# Altium project ACAMP.PrjPcb
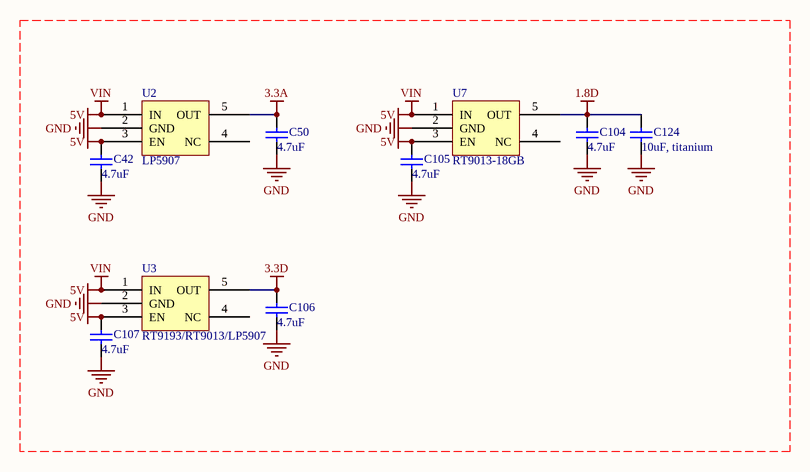
[diagram p0: power.SchDoc]
4 sheets, 97 parts. Net scope: flat (ports and power ports of the same name join across sheets).
Board file: ACAMP.PcbDoc
Sheets:
  power.SchDoc
  CPLD.SchDoc
  mcu.SchDoc
  ADC.SchDoc

## Sheet power.SchDoc
size A4

### Parts
C42  4.7uF  [0603]
C50  4.7uF  [0603]
C104  4.7uF  [0603]
C105  4.7uF  [0603]
C106  4.7uF  [0603]
C107  4.7uF  [0603]
C124  10uF, titanium  [0805]
U2  LP5907  [SOT23-5]
U3  RT9193/RT9013/LP5907  [SOT23-5]
U7  RT9013-18GB  [SOT23-5]

### Nets
1.8D: C104.2 C124.2 U7.5(OUT)
3.3A: C50.2 U2.5(OUT)
3.3D: C106.2 U3.5(OUT)
5V: C42.2 C105.2 C107.2 U2.1(IN) U2.3(EN) U3.1(IN) U3.3(EN) U7.1(IN) U7.3(EN)  [also labelled VIN]
GND: C42.1 C50.1 C104.1 C105.1 C106.1 C107.1 C124.1 U2.2(GND) U3.2(GND) U7.2(GND)

Not connected (* = marked no-connect by the designer): U2 4(NC); U3 4(NC); U7 4(NC)

### Library data of the parts
C42 C50 C104-C107 C124 = Cap: Capacitor; Published: 8-Jun-2000; LatestRevisionDate: 17-Jul-2002; LatestRevisionNote: Re-released for DXP Platform.; PackageReference: RAD-0.3; Publisher: Altium Limited; PackageDescription: Radial Cap, Thru-Hole; 2 Leads; 0.3 in Pin Spacing
U3 U7 = LP5907

## Sheet CPLD.SchDoc
size A4
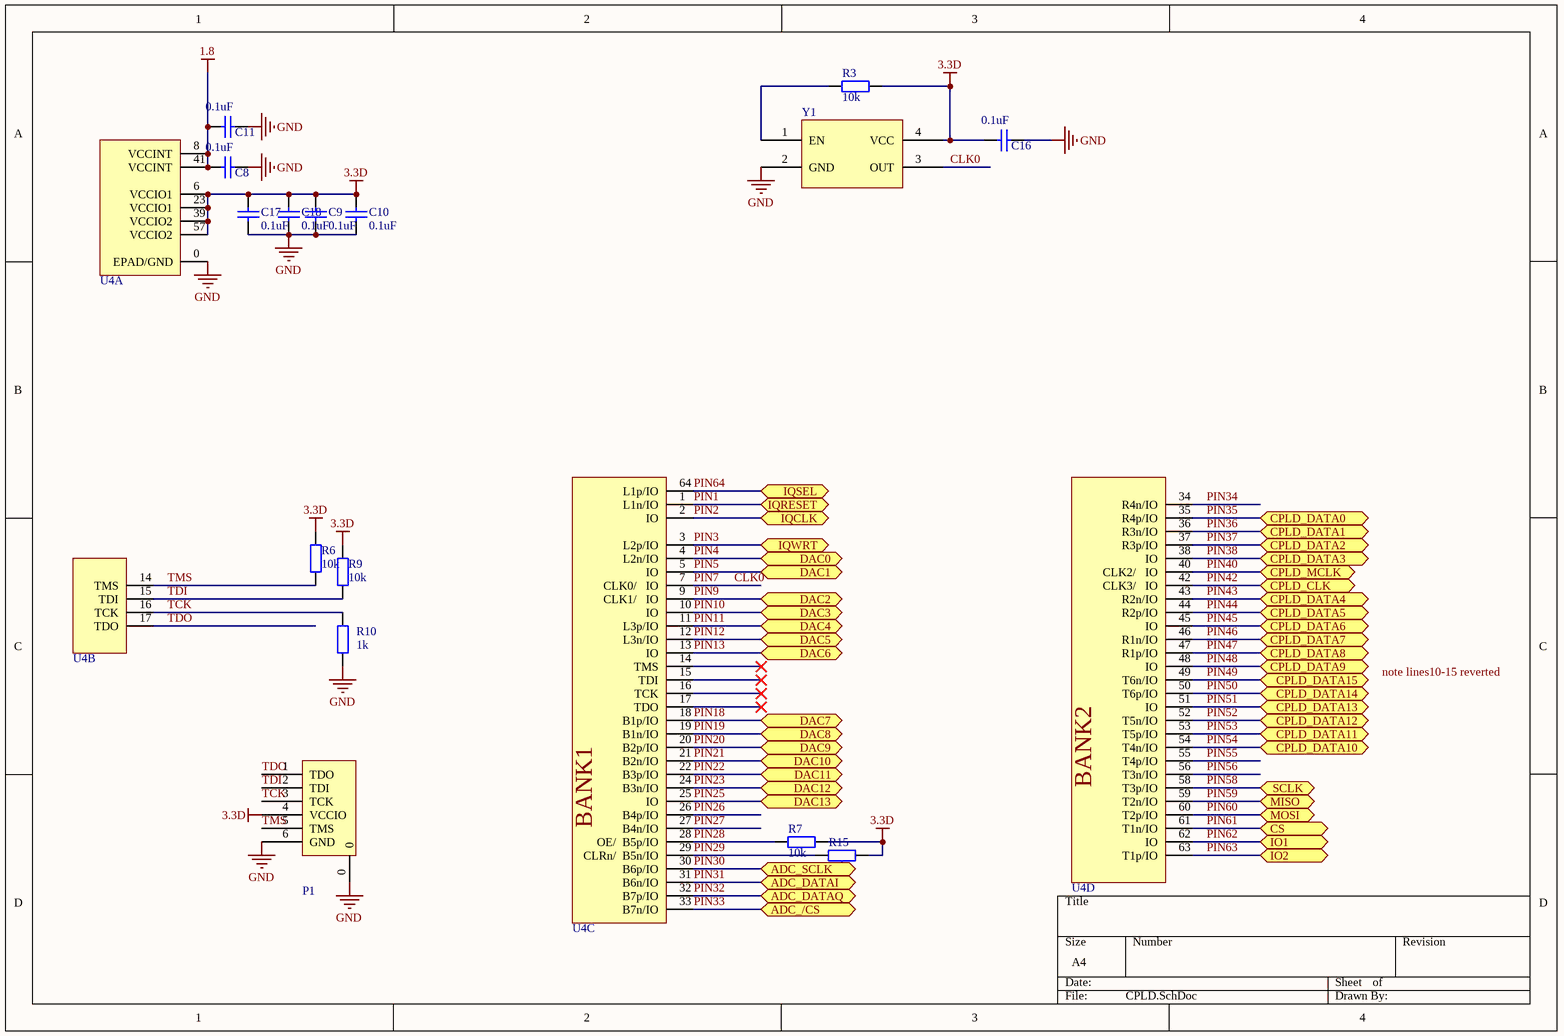
[diagram p1: CPLD.SchDoc]

### Parts
C8  0.1uF  [0402]
C9  0.1uF  [0402]
C10  0.1uF  [0402]
C11  0.1uF  [0402]
C16  0.1uF  [0402]
C17  0.1uF  [0402]
C18  0.1uF  [0402]
P1  JTAG-6P  [GH1.25-6]  (value not drawn)
R3  10k  [0402]
R6  10k  [0402]
R7  10k  [0402]
R9  10k  [0402]
R10  1k  [0402]
R15  10k  [0402]
U4  5M160ZE64  [5M160ZE64]  (value not drawn)  (parts A,B,C,D of 4)
Y1  OSC_50M  [TXC_7Q]  (value not drawn)

### Ports
ADC_/CS, ADC_DATAI, ADC_DATAQ, ADC_SCLK, CPLD_CLK, CPLD_DATA0, CPLD_DATA1, CPLD_DATA2, CPLD_DATA3, CPLD_DATA4, CPLD_DATA5, CPLD_DATA6, CPLD_DATA7, CPLD_DATA8, CPLD_DATA9, CPLD_DATA10, CPLD_DATA11, CPLD_DATA12, CPLD_DATA13, CPLD_DATA14, CPLD_DATA15, CPLD_MCLK, CS, DAC0, DAC1, DAC2, DAC3, DAC4, DAC5, DAC6, DAC7, DAC8, DAC9, DAC10, DAC11, DAC12, DAC13, IO1, IO2, IQCLK, IQRESET, IQSEL, IQWRT, MISO, MOSI, SCLK

### Nets
1.8: C8.2 C11.2 U4.8(VCCINT) U4.41(VCCINT)
3.3D: C9.2 C10.2 C16.2 C17.2 C18.2 P1.4(VCCIO) R3.2 R6.2 R7.2 R9.2 R15.2 U4.6(VCCIO1) U4.23(VCCIO1) U4.39(VCCIO2) U4.57(VCCIO2) Y1.4(VCC)
GND: C8.1 C9.1 C10.1 C11.1 C16.1 C17.1 C18.1 P1.0 P1.6(GND) R10.1 U4.0(EPAD/GND) Y1.2(GND)
CLK0: U4.7(CLK0/___IO) Y1.3(OUT)  [also labelled PIN7]
PIN1: U4.1(L1n/IO) ; port IQRESET
PIN2: U4.2(IO) ; port IQCLK
PIN3: U4.3(L2p/IO) ; port IQWRT
PIN4: U4.4(L2n/IO) ; port DAC0
PIN5: U4.5(IO) ; port DAC1
PIN9: U4.9(CLK1/___IO) ; port DAC2
PIN10: U4.10(IO) ; port DAC3
PIN11: U4.11(L3p/IO) ; port DAC4
PIN12: U4.12(L3n/IO) ; port DAC5
PIN13: U4.13(IO) ; port DAC6
PIN18: U4.18(B1p/IO) ; port DAC7
PIN19: U4.19(B1n/IO) ; port DAC8
PIN20: U4.20(B2p/IO) ; port DAC9
PIN21: U4.21(B2n/IO) ; port DAC10
PIN22: U4.22(B3p/IO) ; port DAC11
PIN23: U4.24(B3n/IO) ; port DAC12
PIN25: U4.25(IO) ; port DAC13
PIN26: U4.26(B4p/IO)
PIN27: U4.27(B4n/IO)
PIN28: R7.1 U4.28(OE/__B5p/IO)
PIN29: R15.1 U4.29(CLRn/__B5n/IO)
PIN30: U4.30(B6p/IO) ; port ADC_SCLK
PIN31: U4.31(B6n/IO) ; port ADC_DATAI
PIN32: U4.32(B7p/IO) ; port ADC_DATAQ
PIN33: U4.33(B7n/IO) ; port ADC_/CS
PIN34: U4.34(R4n/IO)
PIN35: U4.35(R4p/IO) ; port CPLD_DATA0
PIN36: U4.36(R3n/IO) ; port CPLD_DATA1
PIN37: U4.37(R3p/IO) ; port CPLD_DATA2
PIN38: U4.38(IO) ; port CPLD_DATA3
PIN40: U4.40(CLK2/___IO) ; port CPLD_MCLK
PIN42: U4.42(CLK3/___IO) ; port CPLD_CLK
PIN43: U4.43(R2n/IO) ; port CPLD_DATA4
PIN44: U4.44(R2p/IO) ; port CPLD_DATA5
PIN45: U4.45(IO) ; port CPLD_DATA6
PIN46: U4.46(R1n/IO) ; port CPLD_DATA7
PIN47: U4.47(R1p/IO) ; port CPLD_DATA8
PIN48: U4.48(IO) ; port CPLD_DATA9
PIN49: U4.49(T6n/IO) ; port CPLD_DATA15
PIN50: U4.50(T6p/IO) ; port CPLD_DATA14
PIN51: U4.51(IO) ; port CPLD_DATA13
PIN52: U4.52(T5n/IO) ; port CPLD_DATA12
PIN53: U4.53(T5p/IO) ; port CPLD_DATA11
PIN54: U4.54(T4n/IO) ; port CPLD_DATA10
PIN55: U4.55(T4p/IO)
PIN56: U4.56(T3n/IO)
PIN58: U4.58(T3p/IO) ; port SCLK
PIN59: U4.59(T2n/IO) ; port MISO
PIN60: U4.60(T2p/IO) ; port MOSI
PIN61: U4.61(T1n/IO) ; port CS
PIN62: U4.62(IO) ; port IO1
PIN63: U4.63(T1p/IO) ; port IO2
PIN64: U4.64(L1p/IO) ; port IQSEL
TCK: P1.3(TCK) R10.2 U4.16(TCK)
TDI: P1.2(TDI) R9.1 U4.15(TDI)
TDO: P1.1(TDO) U4.17(TDO)
TMS: P1.5(TMS) R6.1 U4.14(TMS)
NetR3_1: R3.1 Y1.1(EN)

### Notes on the sheet
- Labels drawn without touching a wire or pin: note lines10-15 reverted
- (in symbol 5M160ZE64, part C) BANK1
- (in symbol 5M160ZE64, part D) BANK2

### Library data of the parts
C8-C11 C16-C18 = Cap: Capacitor; Published: 8-Jun-2000; LatestRevisionDate: 17-Jul-2002; LatestRevisionNote: Re-released for DXP Platform.; PackageReference: RAD-0.3; Publisher: Altium Limited; PackageDescription: Radial Cap, Thru-Hole; 2 Leads; 0.3 in Pin Spacing
R3 R6 R7 R9 R10 R15 = Res2: Resistor; Published: 8-Jun-2000; LatestRevisionDate: 17-Jul-2002; LatestRevisionNote: Re-released for DXP Platform.; PackageReference: AXIAL-0.4; Publisher: Altium Limited; PackageDescription: Axial Device, Thru-Hole; 2 Leads; 0.4 in Pin Spacing

## Sheet mcu.SchDoc
size A4
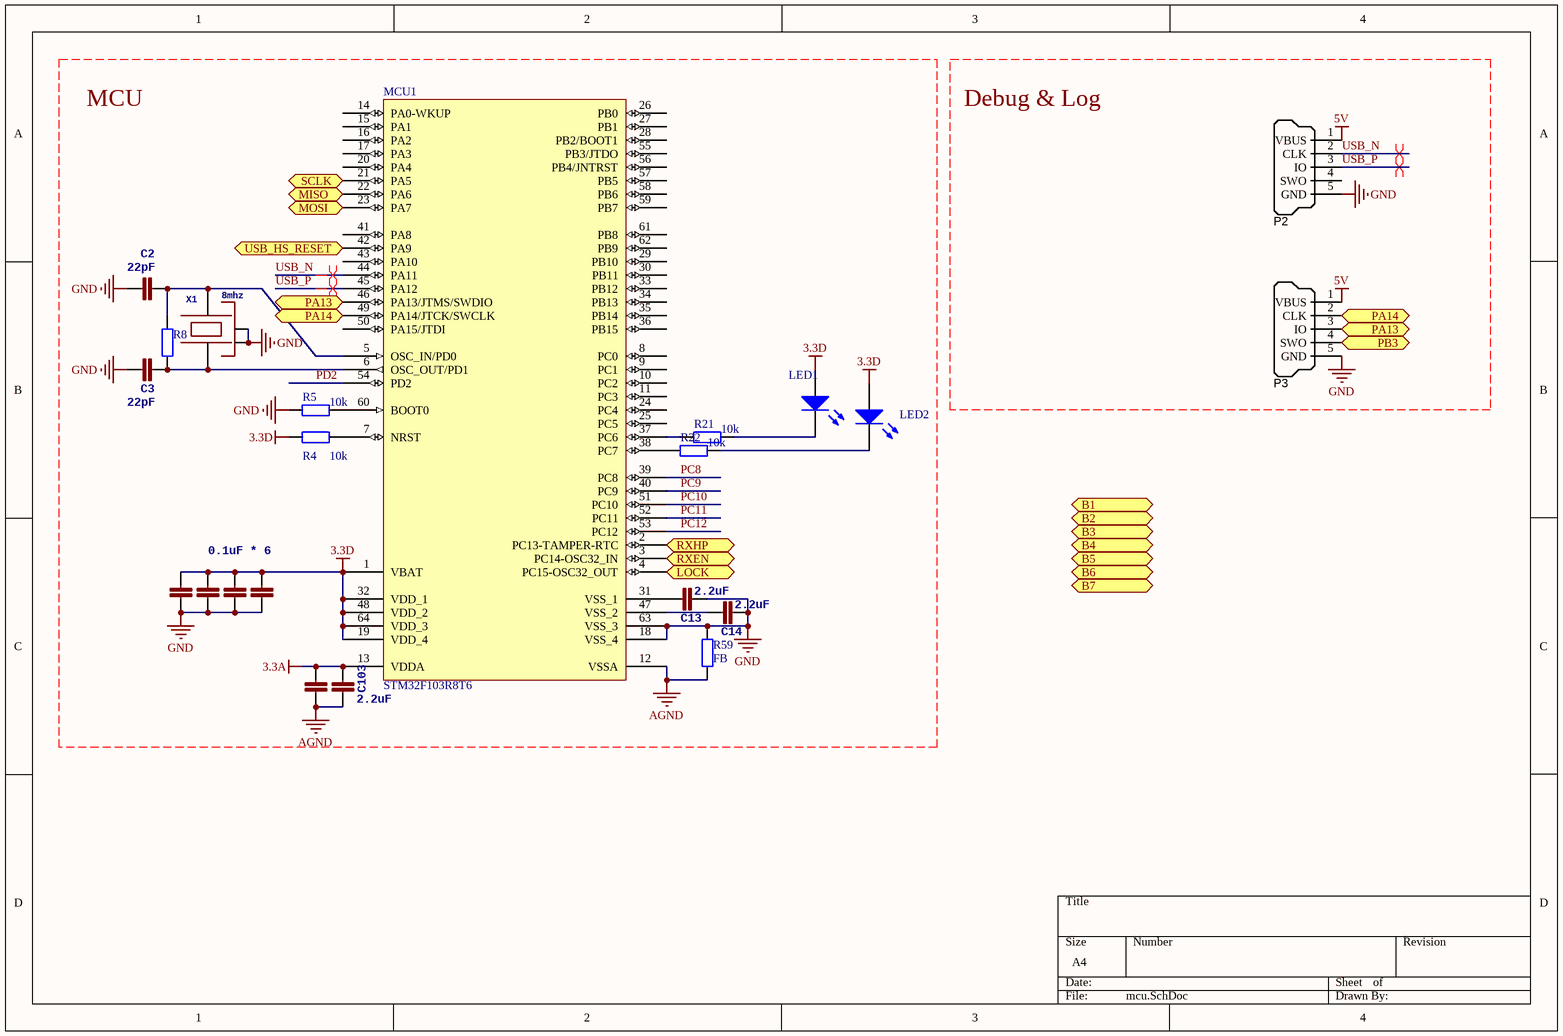
[diagram p2: mcu.SchDoc]

### Parts
C2  22pF  [0402]
C3  22pF  [0402]
C4  0.1uF * 6  [0402]
C5  1n  [0402]  (value not drawn)
C6  1n  [0402]  (value not drawn)
C7  1n  [0402]  (value not drawn)
C13  2.2uF  [0603]
C14  2.2uF  [0603]
C102  1n  [0402]  (value not drawn)
C103  2.2uF  [0603]
LED1  LED0  [0603]  (value not drawn)
LED2  LED0  [0603]  (value not drawn)
MCU1  STM32F103R8T6  [LQFP64_N]
P2  SWD_MicroUSB  [MICRO-YZX]  (value not drawn)
P3  SWD_MicroUSB  [MICRO-YZX]  (value not drawn)
R4  10k  [0402]
R5  10k  [0402]
R8  (no value)  [0402]
R21  10k  [0402]
R22  10k  [0402]
R59  FB  [0402]
X1  8mhz  [OSCILLATOR-3.2X2.5]

### Ports
B1, B2, B3, B4, B5, B6, B7, LOCK, MISO, MOSI, PA13, PA14, PB3, RXEN, RXHP, SCLK, USB_HS_RESET

### Nets
3.3A: C102.2 C103.2 MCU1.13(VDDA)
3.3D: C4.2 C5.2 C6.2 C7.2 LED1.1(A) LED2.1(A) MCU1.1(VBAT) MCU1.19(VDD_4) MCU1.32(VDD_1) MCU1.48(VDD_2) MCU1.64(VDD_3) R4.2
5V: P2.1(VBUS) P3.1(VBUS)
AGND: C102.1 C103.1 MCU1.12(VSSA) R59.2
GND: C2.2 C3.2 C4.1 C5.1 C6.1 C7.1 C13.2 C14.2 MCU1.18(VSS_4) MCU1.63(VSS_3) P2.5(GND) P3.5(GND) R5.1 R59.1 X1.2(NC_2) X1.4(NC_4)
PC8: MCU1.39(PC8)
PC9: MCU1.40(PC9)
PC10: MCU1.51(PC10)
PC11: MCU1.52(PC11)
PC12: MCU1.53(PC12)
PD2: MCU1.54(PD2)
PIN58: MCU1.21(PA5) ; port SCLK
PIN59: MCU1.22(PA6) ; port MISO
PIN60: MCU1.23(PA7) ; port MOSI
USB_N: MCU1.44(PA11) P2.2(CLK)
USB_P: MCU1.45(PA12) P2.3(IO)
NetC2_1: C2.1 MCU1.5(OSC_IN/PD0) R8.2 X1.3
NetC3_1: C3.1 MCU1.6(OSC_OUT/PD1) R8.1 X1.1
NetC13_1: C13.1 MCU1.31(VSS_1)
NetC14_1: C14.1 MCU1.47(VSS_2)
NetLED1_2: LED1.2(K) R21.2
NetLED2_2: LED2.2(K) R22.2
NetMCU1_2: MCU1.2(PC13-TAMPER-RTC) ; port RXHP
NetMCU1_3: MCU1.3(PC14-OSC32_IN) ; port RXEN
NetMCU1_4: MCU1.4(PC15-OSC32_OUT) ; port LOCK
NetMCU1_7: MCU1.7(NRST) R4.1
NetMCU1_37: MCU1.37(PC6) R21.1
NetMCU1_38: MCU1.38(PC7) R22.1
NetMCU1_42: MCU1.42(PA9) ; port USB_HS_RESET
NetMCU1_46: MCU1.46(PA13/JTMS/SWDIO) P3.3(IO) ; port PA13
NetMCU1_49: MCU1.49(PA14/JTCK/SWCLK) P3.2(CLK) ; port PA14
NetMCU1_60: MCU1.60(BOOT0) R5.2
NetP3_4: P3.4(SWO) ; port PB3

Not connected (* = marked no-connect by the designer): MCU1 8(PC0) 9(PC1) 10(PC2) 11(PC3) 14(PA0-WKUP) 15(PA1) 16(PA2) 17(PA3) 20(PA4) 24(PC4) 25(PC5) 26(PB0) 27(PB1) 28(PB2/BOOT1) 29(PB10) 30(PB11) 33(PB12) 34(PB13) 35(PB14) 36(PB15) 41(PA8) 43(PA10) 50(PA15/JTDI) 55(PB3/JTDO) 56(PB4/JNTRST) 57(PB5) 58(PB6) 59(PB7) 61(PB8) 62(PB9); P2 4(SWO)

### Layout directives
differential pair: USB_N, USB_P

### Notes on the sheet
- MCU
- Debug & Log

### Library data of the parts
C2-C7 C13 C14 C102 C103 = CAP0402-CAP: <b>Capacitor</b> / Standard 0603 ceramic capacitor, and 0.1" leaded capacitor.; PARTNO: CC0402ZRY5V7BB104
LED1 LED2 = LED0: Typical INFRARED GaAs LED; Published: 8-Jun-2000; LatestRevisionDate: 08-Jul-2005; LatestRevisionNote: Mech Layer 1 removed.; PackageReference: LED-0; Publisher: Altium Limited; PackageDescription: LED; 2 Leads
MCU1 = STM32F103R8T6: STM32 ARM-based 32-bit MCU with 64 Kbytes Flash, 64-pin LQFP, Industrial Temperature; Published: *; DatasheetVersion: *; PackageVersion: *; PackageReference: *; Publisher: *; PackageDescription: *; ComponentLink1Description: *; ComponentLink1URL: *; ComponentLink2Description: *; ComponentLink2URL: *
P2 P3 = SWD_MicroUSB: Connector SMD USB Micro Type B middle mount; Manufacturer 1: Molex Inc; SCDType: undef; Package / Case: SMD; Supplier 1: Digi-Key; Supplier Part Number 1: WM17142CT-ND
R4 R5 R8 R21 R22 R59 = Res2: Resistor; Value: 0Ohm; Published: 8-Jun-2000; LatestRevisionDate: 17-Jul-2002; LatestRevisionNote: Re-released for DXP Platform.; PackageReference: AXIAL-0.4; Publisher: Altium Limited; PackageDescription: Axial Device, Thru-Hole; 2 Leads; 0.4 in Pin Spacing
X1 = OSCILLATOR-3.2X2.5: Crystal Oscillator in 3.2x2.5 SMD

## Sheet ADC.SchDoc
size A3
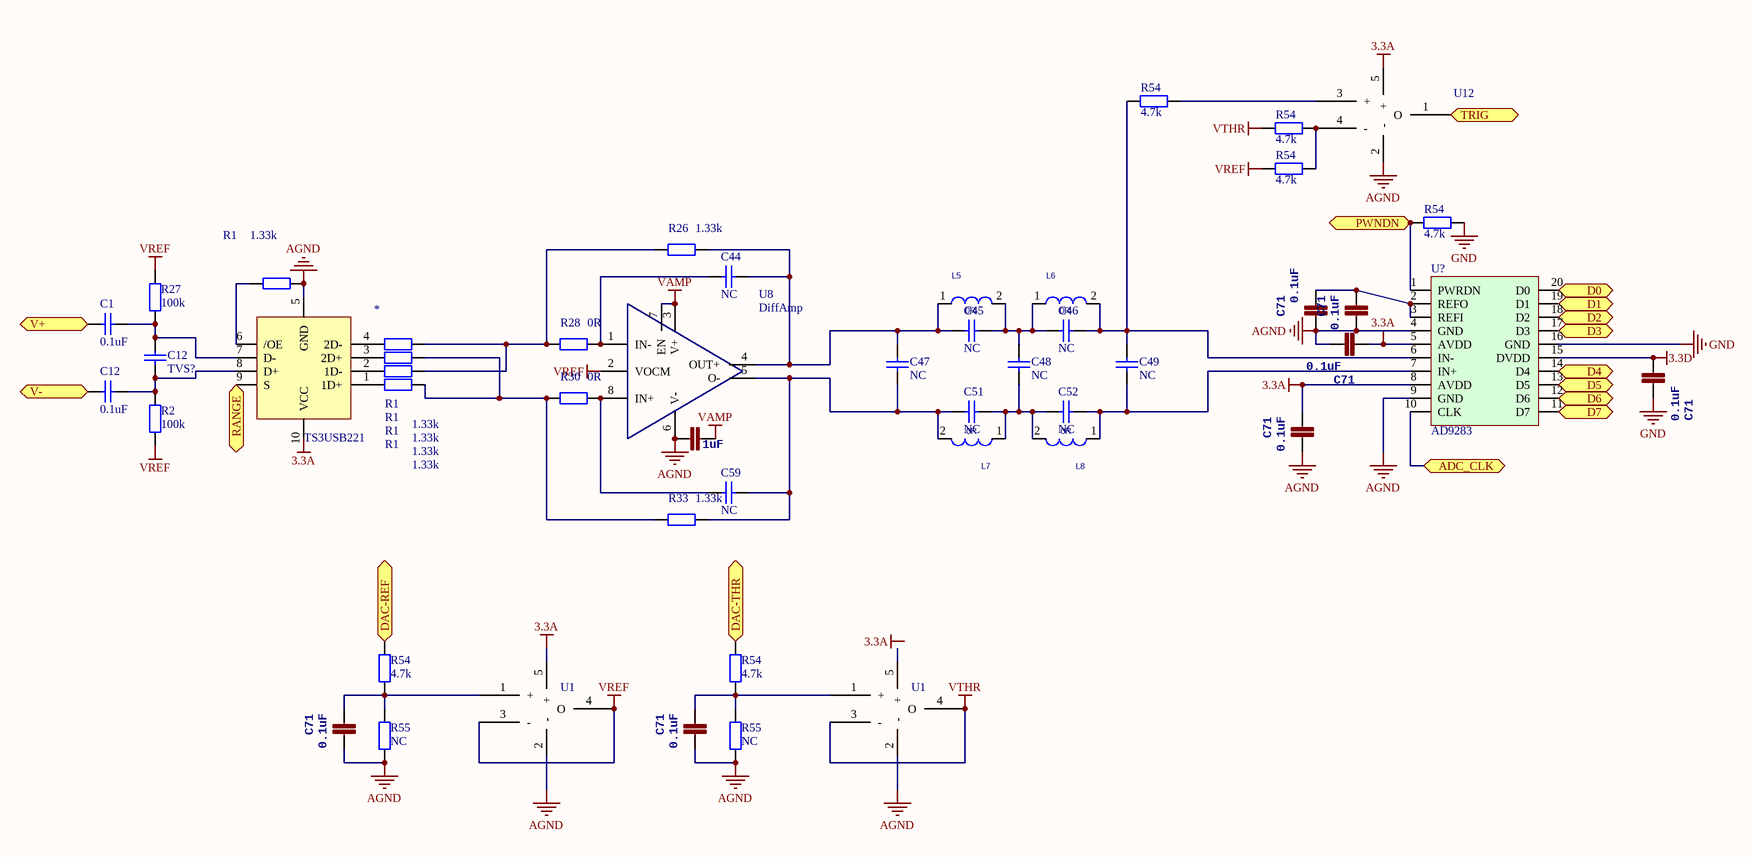
[diagram p3: ADC.SchDoc]

### Parts
(Parts that share a designator on the sheet are numbered #1, #2 ... from top to bottom, then left to right.)
*  TS3USB221  [TS3USB221]
C1  0.1uF  [0402]
C12#1  TVS?  [0402]
C12#2  0.1uF  [0402]
C44  NC  [0402]
C45  NC  [0402]
C46  NC  [0402]
C47  NC  [0402]
C48  NC  [0402]
C49  NC  [0402]
C51  NC  [0402]
C52  NC  [0402]
C59  NC  [0402]
C71#1  0.1uF  [0402]
C71#2  0.1uF  [0402]
C71#3  0.1uF  [0402]
C71#4  0.1uF  [0402]
C71#5  0.1uF  [0402]
C71#6  0.1uF  [0402]
C71#7  0.1uF  [0402]
C90  1uF  [0603]
L5  0R  [0402]
L6  0R  [0402]
L7  0R  [0402]
L8  0R  [0402]
R1#1  1.33k  [0402]
R1#2  1.33k  [0402]
R1#3  1.33k  [0402]
R1#4  1.33k  [0402]
R1#5  1.33k  [0402]
R2  100k  [0402]
R26  1.33k  [0402]
R27  100k  [0402]
R28  0R  [0402]
R30  0R  [0402]
R33  1.33k  [0402]
R54#1  4.7k  [0402]
R54#2  4.7k  [0402]
R54#3  4.7k  [0402]
R54#4  4.7k  [0402]
R54#5  4.7k  [0402]
R54#6  4.7k  [0402]
R55#1  NC  [0402]
R55#2  NC  [0402]
U1#1  OP-SOT23  [SOT23-5]  (value not drawn)
U1#2  OP-SOT23  [SOT23-5]  (value not drawn)
U8  DiffAmp  [MSOP8/VSSOP8]
U12  CMP-SOT23  [SOT23-5]  (value not drawn)
U?  AD9283  [SSOP20]

### Ports
ADC_CLK, D0, D1, D2, D3, D4, D5, D6, D7, DAC-REF, DAC-THR, PWNDN, RANGE, TRIG, V+, V-

### Nets
3.3A: *.10(VCC) C71#3.2 C71#5.1 U1#1.5(+) U12.5(+) U?.5(AVDD) U?.8(AVDD)
3.3D: C71#4.2 U?.15(DVDD)
AGND: *.5(GND) C71#1.2 C71#2.2 C71#3.1 C71#5.2 C71#6.2 C71#7.2 C90.2 R1#1.1 R55#1.2 R55#2.2 U1#1.2(-) U1#2.2(-) U8.6(V-) U12.2(-) U?.4(GND) U?.9(GND)
GND: C71#4.1 R54#4.1 U?.16(GND)
VAMP: C90.1 U8.3(V+) U8.7(EN)
VREF: R2.2 R27.1 R54#3.1 U1#1.3(-) U1#1.4(O) U8.2(VOCM)
VTHR: R54#2.1 U1#2.3(-) U1#2.4(O)
Net*_1: *.1(1D+) R1#5.2
Net*_2: *.2(1D-) R1#4.2
Net*_3: *.3(2D+) R1#3.2
Net*_4: *.4(2D-) R1#2.2
Net*_6: *.6(/OE) R1#1.2
Net*_7: *.7(D-) C1.1 C12#1.1 R27.2
Net*_8: *.8(D+) C12#1.2 C12#2.1 R2.1
Net*_9: *.9(S) ; port RANGE
NetC1_2: C1.2 ; port V+
NetC12#2_2: C12#2.2 ; port V-
NetC44_1: C44.1 C45.2 C47.2 L5.1 R26.1 U8.4(OUT+)
NetC44_2: C44.2 R28.1 U8.1(IN-)
NetC45_1: C45.1 C46.2 C48.2 L5.2 L6.1
NetC46_1: C46.1 C49.2 L6.2 R54#1.1 U?.6(IN-)
NetC47_1: C47.1 C51.1 C59.1 L7.2 R33.1 U8.5(O-)
NetC48_1: C48.1 C51.2 C52.1 L7.1 L8.2
NetC49_1: C49.1 C52.2 L8.1 U?.7(IN+)
NetC59_2: C59.2 R30.1 U8.8(IN+)
NetC71#1_1: C71#1.1 C71#2.1 U?.2(REFO) U?.3(REFI)
NetC71#6_1: C71#6.1 R54#5.2 R55#1.1 U1#1.1(+)
NetC71#7_1: C71#7.1 R54#6.2 R55#2.1 U1#2.1(+)
NetR1#2_1: R1#2.1 R1#4.1 R26.2 R28.2
NetR1#3_1: R1#3.1 R1#5.1 R30.2 R33.2
NetR54#1_2: R54#1.2 U12.3(+)
NetR54#2_2: R54#2.2 R54#3.2 U12.4(-)
NetR54#4_2: R54#4.2 U?.1(PWRDN) ; port PWNDN
NetR54#5_1: R54#5.1 ; port DAC-REF
NetR54#6_1: R54#6.1 ; port DAC-THR
NetU12_1: U12.1(O) ; port TRIG
NetU?_10: U?.10(CLK) ; port ADC_CLK
NetU?_11: U?.11(D7) ; port D7
NetU?_12: U?.12(D6) ; port D6
NetU?_13: U?.13(D5) ; port D5
NetU?_14: U?.14(D4) ; port D4
NetU?_17: U?.17(D3) ; port D3
NetU?_18: U?.18(D2) ; port D2
NetU?_19: U?.19(D1) ; port D1
NetU?_20: U?.20(D0) ; port D0

Not connected (* = marked no-connect by the designer): U1#2 5(+)

### Notes on the sheet
- Labels drawn without touching a wire or pin: 3.3A

### Library data of the parts
C1 C12#1 C12#2 C44-C49 C51 C52 C59 = Cap: Capacitor; Published: 8-Jun-2000; LatestRevisionDate: 17-Jul-2002; LatestRevisionNote: Re-released for DXP Platform.; PackageReference: RAD-0.3; Publisher: Altium Limited; PackageDescription: Radial Cap, Thru-Hole; 2 Leads; 0.3 in Pin Spacing
C71#1-C71#7 C90 = CAP0402-CAP: as C2 on sheet mcu
L5-L8 = L/2.5*2.0
R1#1-R1#5 R2 R26-R28 R30 R33 = Res2: Resistor; Value: 0Ohm; Published: 8-Jun-2000; LatestRevisionDate: 17-Jul-2002; LatestRevisionNote: Re-released for DXP Platform.; PackageReference: AXIAL-0.4; Publisher: Altium Limited; PackageDescription: Axial Device, Thru-Hole; 2 Leads; 0.4 in Pin Spacing
R54#1-R54#6 R55#1 R55#2 = Res2: Resistor; Published: 8-Jun-2000; LatestRevisionDate: 17-Jul-2002; LatestRevisionNote: Re-released for DXP Platform.; PackageReference: AXIAL-0.4; Publisher: Altium Limited; PackageDescription: Axial Device, Thru-Hole; 2 Leads; 0.4 in Pin Spacing

## Nets that join several sheets
3.3A: power (C50.2 U2.5), mcu (C102.2 C103.2 MCU1.13), ADC (7 pins)
3.3D: power (C106.2 U3.5), CPLD (16 pins), mcu (12 pins), ADC (C71#4.2 U?.15)
5V: power (9 pins), mcu (P2.1 P3.1)
AGND: mcu (C102.1 C103.1 MCU1.12 R59.2), ADC (17 pins)
GND: power (10 pins), CPLD (12 pins), mcu (16 pins), ADC (C71#4.1 R54#4.1 U?.16)
PIN58: CPLD (U4.58), mcu (MCU1.21)
PIN59: CPLD (U4.59), mcu (MCU1.22)
PIN60: CPLD (U4.60), mcu (MCU1.23)